# Altium schematic sheet mcu.SchDoc
size A; SheetNumber: 7; SheetTotal: 6
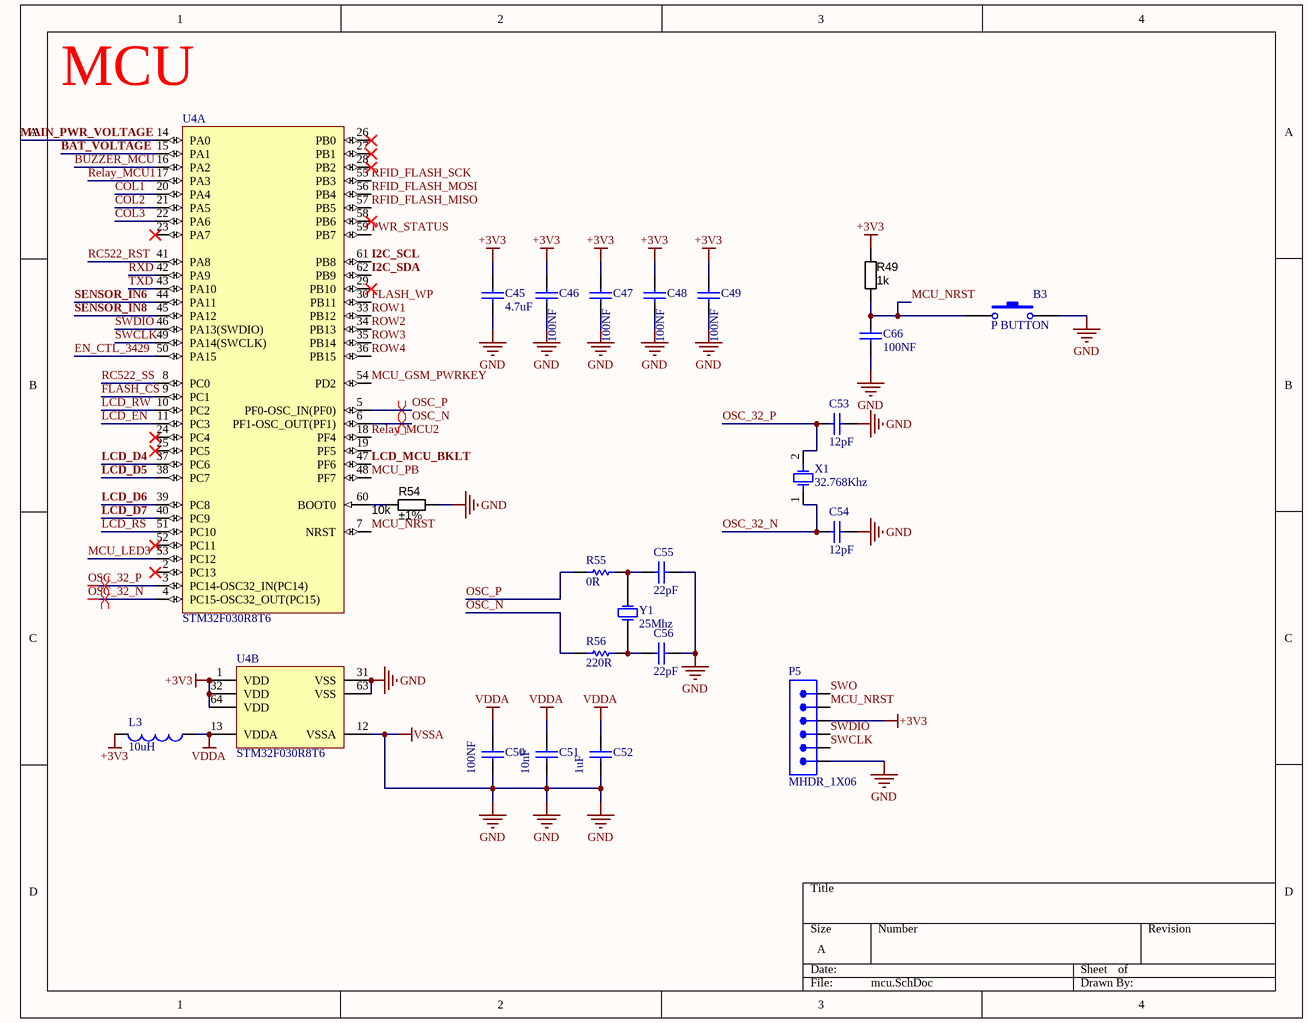
[diagram p0: mcu.SchDoc]

## Parts
B3  P BUTTON  [MY_SPST-0.5]
C45  4.7uF  [MY_CAP_SMD_0603]
C46  100NF  [CAP0603]
C47  100NF  [CAP0603]
C48  100NF  [CAP0603]
C49  100NF  [CAP0603]
C50  100NF  [CAP0603]
C51  10nF  [MY_CAP_SMD_0603]
C52  1uF  [MY_CAP_SMD_1206]
C53  12pF  [CAP0603]
C54  12pF  [CAP0603]
C55  22pF  [CAP0603]
C56  22pF  [CAP0603]
C66  100NF  [MY_CAP_SMD_0603]
L3  10uH  [INDC3216]
P5  MHDR_1X06  [MHDR1X06-254P]
R49  1k  [RESC1608X55N]
R54  10k  Tolerance: ±1%  [RESC1608X55N]
R55  0R  [R0603]
R56  220R  [R0603]
U4  STM32F030R8T6  [STM-LQFP64_N]  (parts A,B of 2)
X1  32.768Khz  [XTL_2_3215]
Y1  25Mhz  [Crystal SMD]

## Nets
+3V3: C45.2 C46.2 C47.2 C48.2 C49.2 L3.2 P5.3 R49.2 U4.1(VDD) U4.32(VDD) U4.64(VDD)
GND: B3.2 C45.1 C46.1 C47.1 C48.1 C49.1 C50.1 C51.1 C52.1 C53.1 C54.1 C55.1 C56.1 C66.1 P5.6 R54.2 U4.12(VSSA) U4.31(VSS) U4.63(VSS)  [also labelled VSSA]
VDDA: C50.2 C51.2 C52.2 L3.1 U4.13(VDDA)
BAT_VOLTAGE: U4.15(PA1)
BUZZER_MCU: U4.16(PA2)
COL1: U4.20(PA4)
COL2: U4.21(PA5)
COL3: U4.22(PA6)
EN_CTL_3429: U4.50(PA15)
FLASH_CS: U4.9(PC1)
FLASH_WP: U4.30(PB11)
I2C_SCL: U4.61(PB8)
I2C_SDA: U4.62(PB9)
LCD_D4: U4.37(PC6)
LCD_D5: U4.38(PC7)
LCD_D6: U4.39(PC8)
LCD_D7: U4.40(PC9)
LCD_EN: U4.11(PC3)
LCD_MCU_BKLT: U4.47(PF6)
LCD_RS: U4.51(PC10)
LCD_RW: U4.10(PC2)
MAIN_PWR_VOLTAGE: U4.14(PA0)
MCU_GSM_PWRKEY: U4.54(PD2)
MCU_LED3: U4.53(PC12)
MCU_NRST: B3.1 C66.2 P5.2 R49.1 U4.7(NRST)
MCU_PB: U4.48(PF7)
OSC_32_N: C54.2 U4.4(PC15-OSC32_OUT(PC15)) X1.1(OSC1)
OSC_32_P: C53.2 U4.3(PC14-OSC32_IN(PC14)) X1.2(OSC2)
OSC_N: R56.2 U4.6(PF1-OSC_OUT(PF1))
OSC_P: R55.2 U4.5(PF0-OSC_IN(PF0))
PWR_STATUS: U4.59(PB7)
RC522_RST: U4.41(PA8)
RC522_SS: U4.8(PC0)
Relay_MCU1: U4.17(PA3)
Relay_MCU2: U4.18(PF4)
RFID_FLASH_MISO: U4.57(PB5)
RFID_FLASH_MOSI: U4.56(PB4)
RFID_FLASH_SCK: U4.55(PB3)
ROW1: U4.33(PB12)
ROW2: U4.34(PB13)
ROW3: U4.35(PB14)
ROW4: U4.36(PB15)
RXD: U4.42(PA9)
SENSOR_IN6: U4.44(PA11)
SENSOR_IN8: U4.45(PA12)
SWCLK: P5.5 U4.49(PA14(SWCLK))
SWDIO: P5.4 U4.46(PA13(SWDIO))
SWO: P5.1
TXD: U4.43(PA10)
NetC55_2: C55.2 R55.1 Y1.2(OSC2)
NetC56_2: C56.2 R56.1 Y1.1(OSC1)
NetR54_1: R54.1 U4.60(BOOT0)

Not connected (* = marked no-connect by the designer): U4 2(PC13)* 19(PF5) 23(PA7)* 24(PC4)* 25(PC5)* 26(PB0)* 27(PB1)* 28(PB2)* 29(PB10)* 52(PC11)* 58(PB6)*

## Layout directives
differential pair: OSC_32_N, OSC_32_P, OSC_N, OSC_P

## Notes on the sheet
- (near U4) MCU

## Library data of the parts
B3 = PUSH BUTTON_SMALL
C45 C51 C66 = CAP SMD_0603: 1.6 mm × 0.8 mm
C46-C50 = CAP SMD PACKAGE: TOTAL CAPACITOR SMD PACK; Designer: Abbas Basereh; Desc.: CAP SMD TOTAL PACKAGES; Data: 2017-3-10; VALUE: 100nF
C52 = CAP SMD_1206: 3.2 mm × 1.6 mm
C53-C56 = CAP SMD PACKAGE: TOTAL CAPACITOR SMD PACK; Designer: Abbas Basereh; Desc.: CAP SMD TOTAL PACKAGES; VALUE: 100nF; Data: 2017-3-10
L3 = Inductor: Code_IEC: 1005; Published: 8-Jun-2000; LatestRevisionDate: 29-May-2009; LatestRevisionNote: IPC-7351 Footprint Added.; PackageReference: 0402-A; Publisher: Altium Limited; PackageDescription: Chip Inductor; Code_JEITA: 0402
P5 = MHDR_1X06: Male Header 1X06
R49 R54 = RES_1K_0603_1%: Resistor SMD chip 1k Ohm 0.1W 1% 0603; Manufacturer 1: Yageo; Manufacturer Part Number 1: RC0603FR-071KL; Ratings: 1/10W; SCDType: spec; Package / Case: 0603 (1608 Metric); Supplier 1: Digi-Key; Supplier Part Number 1: 311-1.00KHRCT-ND; Value: 1K
R55 R56 = Resistor SMD 0603: Value: 1K; DatasheetVersion: 2021; ComponentLink1Description: Website Smart World; ComponentLink1URL: https://www.smartw.ir/; ComponentLink2Description: Telegram; ComponentLink2URL: https://t.me/altium_smartw; ComponentLink3Description: Instagram; ComponentLink3URL: https://Instagram.com/smartgw.ir
U4 = STM32F030R8T6: ARM Cortex-M0 32-bit MCU, 64 KB Flash, 8 KB Internal RAM, 55 I/Os, 64-pin LQFP, -40 to 85 degC, Tray; ComponentLink1Description: Website: Tarahiboard; ComponentLink1URL: https://www.tarahiboard.com
X1 = Crystal 2 PIN: Crystal, 32.768KHz, 9pF, 20PPM; ComponentLink1Description: Website Smart World; ComponentLink1URL: https://www.smartw.ir/; ComponentLink2Description: Telegram; ComponentLink2URL: https://t.me/altium_smartw; ComponentLink3Description: Instagram; ComponentLink3URL: https://Instagram.com/smartgw.ir; DatasheetVersion: 2021
Y1 = XTAL_Crystal: XTAL Crystal; Designer: ABBAS BASEREH; Value: 12 MHz; Design Date: 2017-1-3; ComponentLink1Description: Datasheet; ComponentLink2Description: Reference; Mounting Technology: Surface Mount\Through-Hole; Status: Unreleased